# EasyEDA Pro project ProPrj_W51F6240S16_DEVB_V2_2026-07-19.epro

# Schematic Schematic1
Board Name: Board1; Create Date: 2026-07-16; Page Name: P1; Project Name: W51F6240S16_DEVB_V2; Schematic Name: Schematic1; Update Date: 2026-07-17; Company: EasyEDA.com; Page Size: A4; Version: V1.0
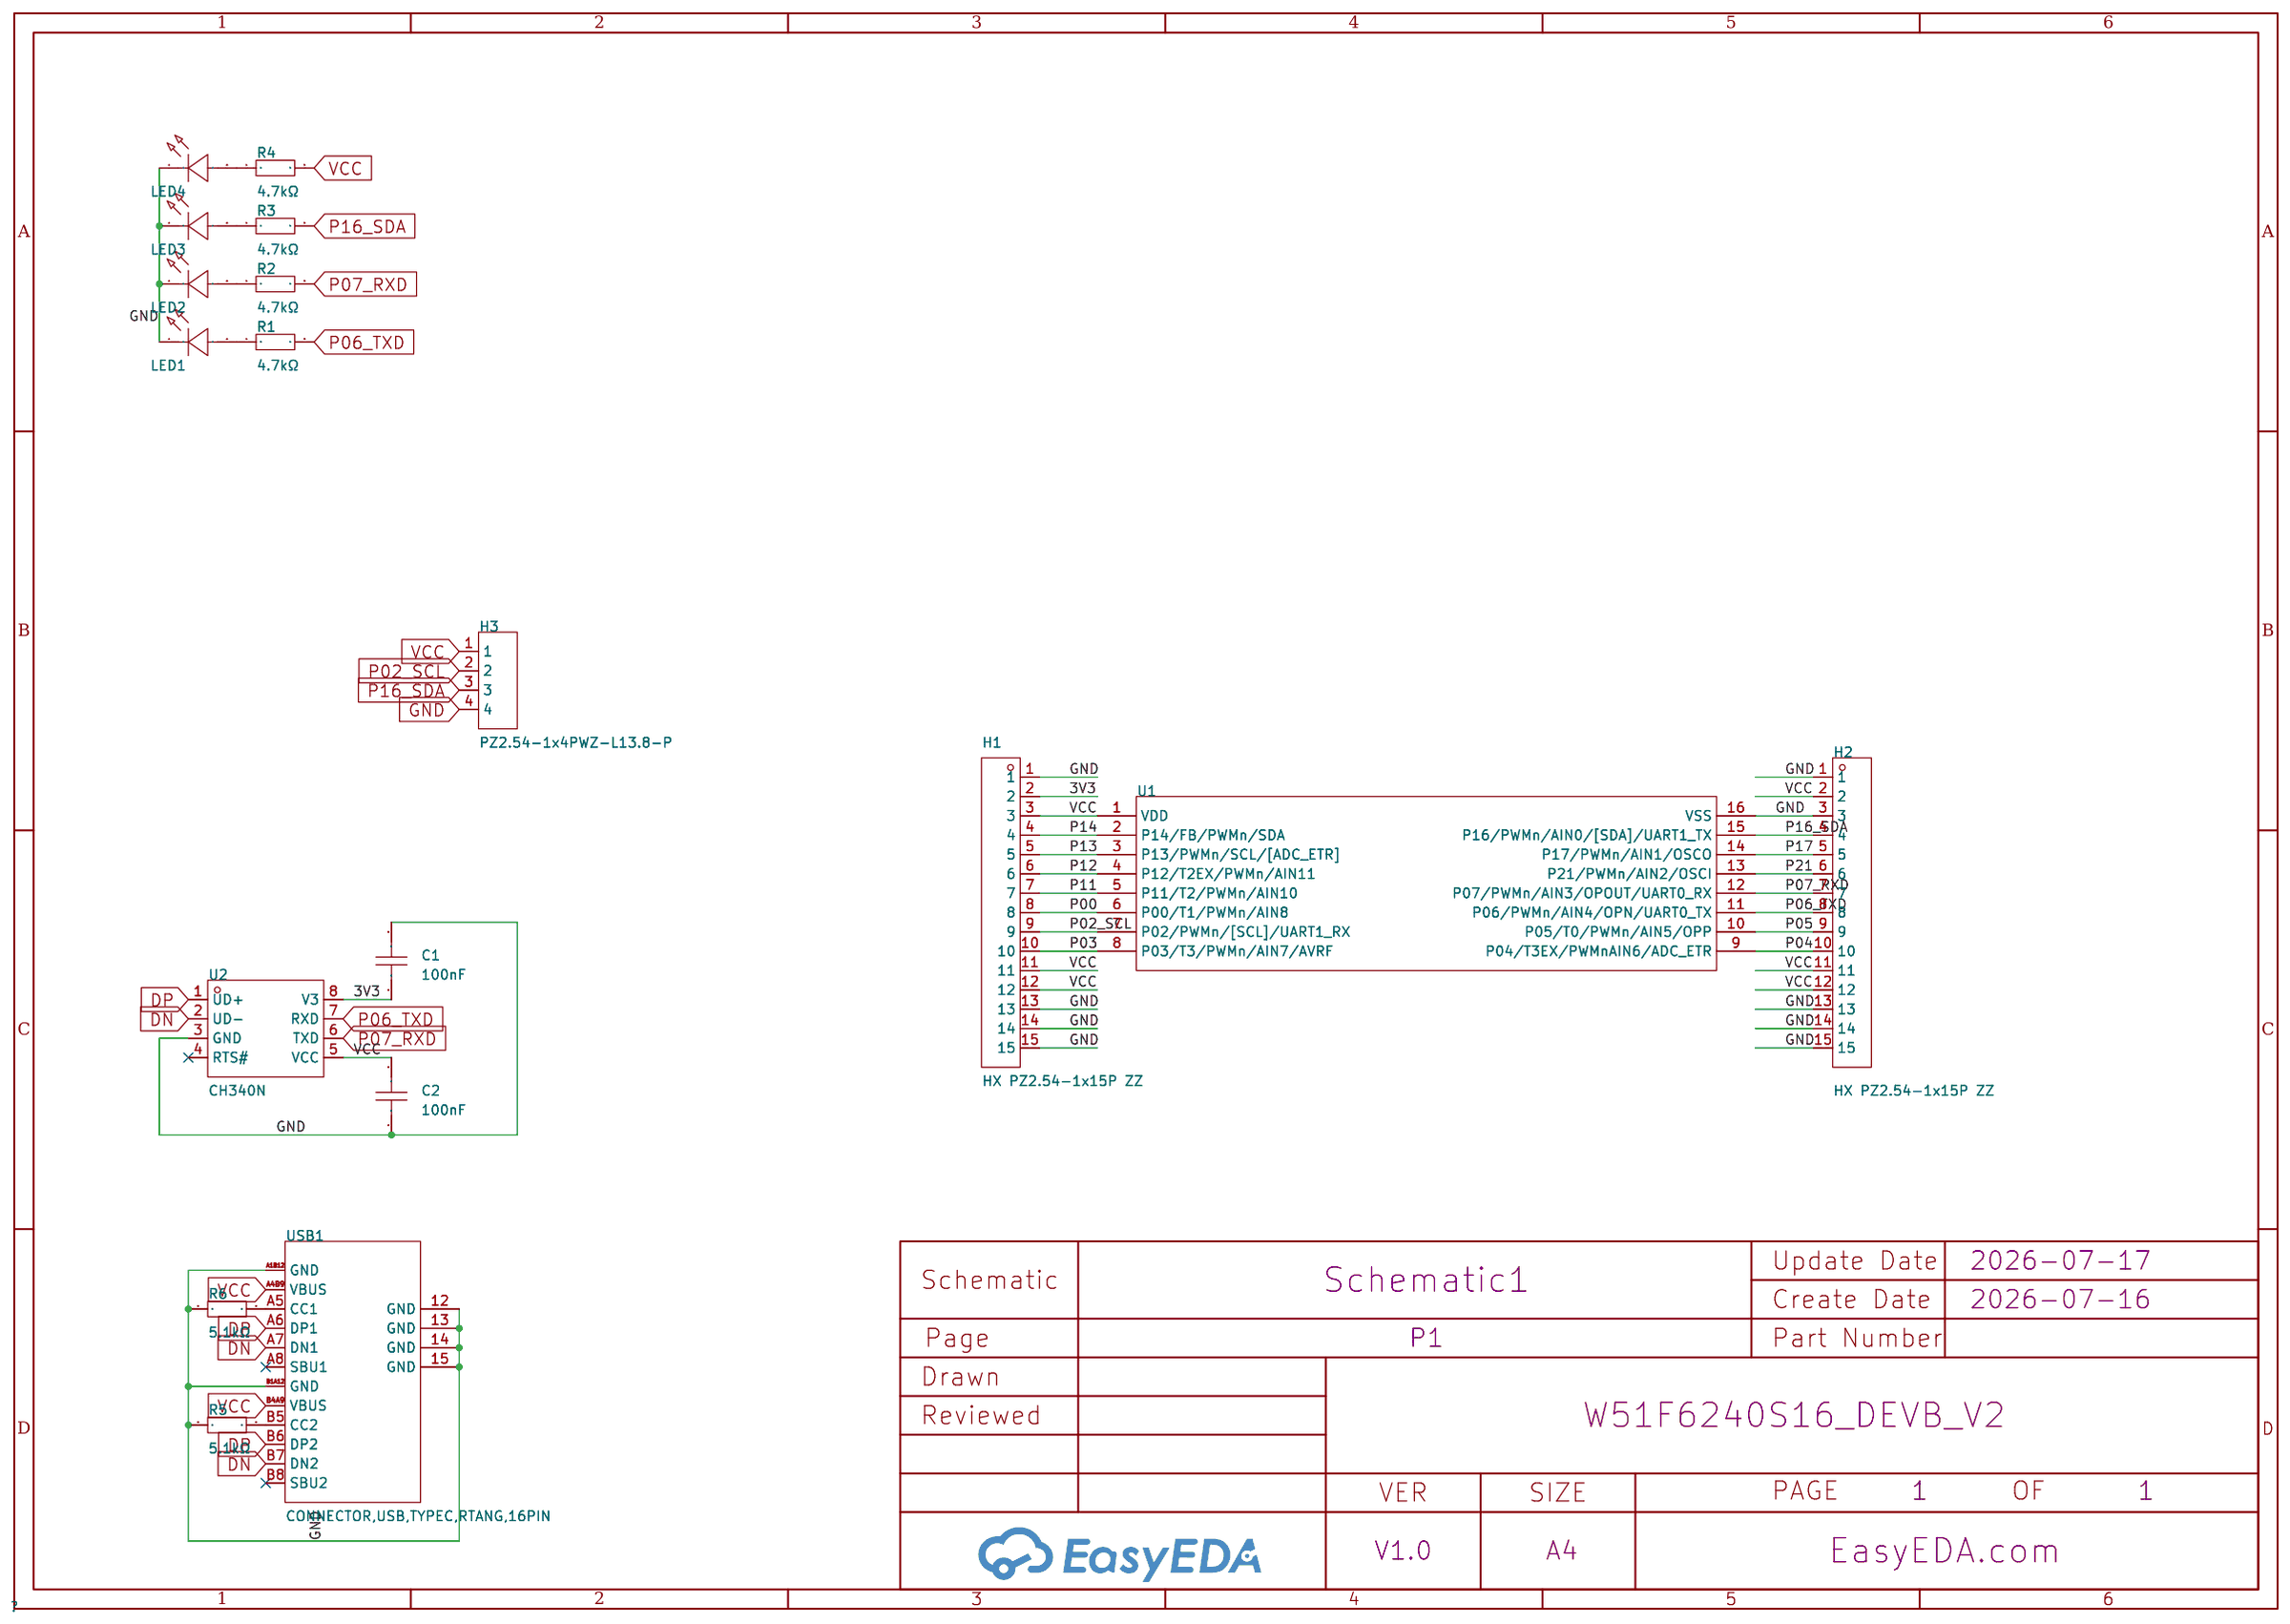
[diagram p0: schematic sheet]

## Parts
C1  100nF  [C1206]
C2  100nF  [C1206]
H1  HX PZ2.54-1x15P ZZ  [HDR-TH_15P-P2.54-V-M]
H2  HX PZ2.54-1x15P ZZ  [HDR-TH_15P-P2.54-V-M]
H3  PZ2.54-1x4PWZ-L13.8-P  [HDR-TH_4P-P2.54-H-M-W7.7-P]
LED1  LED1206  [LED1206-RD]
LED2  LED1206  [LED1206-RD]
LED3  LED1206  [LED1206-RD]
LED4  LED1206  [LED1206-RD]
R1  4.7kΩ  [R1206]
R2  4.7kΩ  [R1206]
R3  4.7kΩ  [R1206]
R4  4.7kΩ  [R1206]
R5  5.1kΩ  [R1206]
R6  5.1kΩ  [R1206]
U1  -  [SOP-16_L10.0-W3.9-P1.27-LS6.0-TR]
U2  CH340N  [SOP-8_L5.0-W4.0-P1.27-LS6.0-BL]
USB1  CONNECTOR,USB,TYPEC,RTANG,16PIN  [USB-SMD_TYPEC-16PIN]

## Library data of the parts
C1 C2 = FN31N104J500EPG: Capacitance:100nF Tolerance:±5% Tolerance:±5% Voltage Rating:50V Temperature Coefficient:C0G; LCSC Part Name: 100nF ±5% 50V; Supplier Part: C2874765; Manufacturer: PSA(信昌电陶); Supplier Footprint: 1206; JLCPCB Part Class: Extended Part; Datasheet: https://item.szlcsc.com/datasheet/FN31N104J500EPG/3080170.html; Supplier: LCSC; Tolerance: ±5%; Voltage Rating: 50V; Temperature Coefficient: C0G
H1 H2 = HX PZ2.54-1x15P ZZ: Pin Structure:1x15P Pitch:2.54mm Row Spacing:- Circluar Pins/Square Pins:Pin Header Mounting Type:Through Hole Number of Rows:1 Number of Pins:15P Current Rating:3A Voltage Rating (Max):1kV Length of Mating Pin:6mm Insulation Height:2.5mm Length of End Co; LCSC Part Name: 1x15P 间距:2.54mm 方针 直插; Supplier Part: C42372507; Manufacturer: hanxia(韩下); Supplier Footprint: 插件,P=2.54mm; Datasheet: https://item.szlcsc.com/datasheet/HX%2520PZ2.54-1x15P%2520ZZ/44255748.html; Supplier: LCSC; Pin Structure: 1x15P; Pitch: 2.54mm; Circluar Pins/Square Pins: Pin Header; Mounting Type: Through Hole; Number of Rows: 1; Number of Pins: 15P; Current Rating: 3A; Voltage Rating (Max): 1kV; Length of Mating Pin: 6mm; Insulation Height: 2.5mm; Length of End Connection Pin: 3mm; Contact Material: Brass; Contact Plating: Gold; Operating Temperature: -40℃~+105℃; Color: Black
H3 = PZ2.54-1x4PWZ-L13.8-P: Pin Structure:1x4P Pitch:2.54mm Row Spacing:2.54mm Circluar Pins/Square Pins:Pin Header Mounting Type:Right Angle Number of Rows:1 Number of Pins:4P Current Rating:3A Voltage Rating (Max):250V Length of Mating Pin:6mm Insulation Height:2.5mm Length of End; LCSC Part Name: 1x4P 间距:2.54mm 方针 弯插; Supplier Part: C54907654; Manufacturer: SHOU HAN(首韩); Supplier Footprint: 弯插,P=2.54mm; JLCPCB Part Class: Extended Part; Datasheet: https://item.szlcsc.com/datasheet/PZ2.54-1x4PWZ-L13.8-P/58437423.html; Supplier: LCSC; Pin Structure: 1x4P; Pitch: 2.54mm; Row Spacing: 2.54mm; Circluar Pins/Square Pins: Pin Header; Mounting Type: Right Angle; Number of Rows: 1; Number of Pins: 4P; Current Rating: 3A; Voltage Rating (Max): 250V; Length of Mating Pin: 6mm; Insulation Height: 2.5mm; Length of End Connection Pin: 3mm; Contact Material: Brass; Contact Plating: Gold; Operating Temperature: -40℃~+105℃; Color: Black
LED1-LED4 = LED1206: Supplier Part: C9900027223; JLCPCB Part Class: Extended Part; Supplier: LCSC
R1-R4 = RS-06K472FT: Type:Thick Film Resistors Resistance:4.7kΩ Tolerance:±1% Tolerance:±1% Power(Watts): Temperature Coefficient:±100ppm/℃ Temperature Coefficient:±100ppm/℃; LCSC Part Name: 厚膜电阻 4.7kΩ ±1% 250mW; Supplier Part: C304895; Manufacturer: FH(风华); Supplier Footprint: 1206; JLCPCB Part Class: Extended Part; Datasheet: https://atta.szlcsc.com/upload/public/pdf/source/20190505/C118335_36085569433BA7FFC796E569DBFE3139.pdf; Supplier: LCSC; Type: Thick Film Resistors; Tolerance: ±1%; Temperature Coefficient: ±100ppm/℃
R5 R6 = AC1206FR-075K1L: Type:Thick Film Resistor Resistance:5.1kΩ Tolerance:±1% Tolerance:±1% Power(Watts):250mW Voltage-Supply(Max):200V Temperature Coefficient:±100ppm/℃ Temperature Coefficient:±100ppm/℃ Operating Temperature:-55℃~+155℃ Operating Temperature:-55℃~+155℃; LCSC Part Name: 厚膜电阻 5.1kΩ ±1% 250mW; Supplier Part: C229719; Manufacturer: YAGEO(国巨); Supplier Footprint: 1206; JLCPCB Part Class: Extended Part; Datasheet: https://item.szlcsc.com/datasheet/AC1206FR-075K1L/229699.html; Supplier: LCSC; Type: Thick Film Resistor; Tolerance: ±1%; Power(Watts): 250mW; Voltage-Supply(Max): 200V; Temperature Coefficient: ±100ppm/℃; Operating Temperature: -55℃~+155℃
U1 = W51F6240S16: Low cost 1T 8051 MCU
U2 = CH340N_C506813: Applications Function:USB to serial USB Protocol:USB 2.0 Number of Channels:- Voltage - Supply:3.3V；5V Voltage - Supply:3.3V；5V Data Rate:2Mbps Operating Temperature:-20℃~+70℃ Operating Temperature:-20℃~+70℃ Features:Programmable baud rate；Built-in clock; LCSC Part Name: USB转串口芯片CH340; Supplier Part: C506813; Manufacturer: WCH(南京沁恒); Supplier Footprint: SOP-8; JLCPCB Part Class: Extended Part; Datasheet: https://item.szlcsc.com/datasheet/CH340N/519976.html; Supplier: LCSC; Applications Function: USB to serial; USB Protocol: USB 2.0; Voltage - Supply: 3.3V；5V; Data Rate: 2Mbps; Operating Temperature: -20℃~+70℃; Features: Programmable baud rate；Built-in clock generator；Power-off protection；Power-on reset
USB1 = CONNECTOR,USB,TYPEC,RTANG,16PIN: Supplier Part: C9900022254; Supplier Footprint: USBTypeC; JLCPCB Part Class: Extended Part; Supplier: LCSC

## Nets
3V3: C1.1 H1.2 U2.8(V3)
GND: C1.2 C2.1 H1.1 H1.13 H1.14 H1.15 H2.1 H2.3 H2.13 H2.14 H2.15 H3.4 LED1.1(K) LED2.1(K) LED3.1(K) LED4.1(K) R5.1 R6.1 U1.16(VSS) U2.3(GND) USB1.12(GND) USB1.13(GND) USB1.14(GND) USB1.15(GND) USB1.A1B12(GND) USB1.B1A12(GND)
VCC: C2.2 H1.3 H1.11 H1.12 H2.2 H2.11 H2.12 H3.1 R4.2 U1.1(VDD) U2.5(VCC) USB1.A4B9(VBUS) USB1.B4A9(VBUS)
DN: U2.2(UD-) USB1.A7(DN1) USB1.B7(DN2)
DP: U2.1(UD+) USB1.A6(DP1) USB1.B6(DP2)
P00: H1.8 U1.6(P00/T1/PWMn/AIN8)
P02_SCL: H1.9 H3.2 U1.7(P02/PWMn/[SCL]/UART1_RX)
P03: H1.10 U1.8(P03/T3/PWMn/AIN7/AVRF)
P04: H2.10 U1.9(P04/T3EX/PWMnAIN6/ADC_ETR)
P05: H2.9 U1.10(P05/T0/PWMn/AIN5/OPP)
P06_TXD: H2.8 R1.2 U1.11(P06/PWMn/AIN4/OPN/UART0_TX) U2.7(RXD)
P07_RXD: H2.7 R2.2 U1.12(P07/PWMn/AIN3/OPOUT/UART0_RX) U2.6(TXD)
P11: H1.7 U1.5(P11/T2/PWMn/AIN10)
P12: H1.6 U1.4(P12/T2EX/PWMn/AIN11)
P13: H1.5 U1.3(P13/PWMn/SCL/[ADC_ETR])
P14: H1.4 U1.2(P14/FB/PWMn/SDA)
P16_SDA: H2.4 H3.3 R3.2 U1.15(P16/PWMn/AIN0/[SDA]/UART1_TX)
P17: H2.5 U1.14(P17/PWMn/AIN1/OSCO)
P21: H2.6 U1.13(P21/PWMn/AIN2/OSCI)
$1N5175: LED1.2(A) R1.1
$1N5302: LED2.2(A) R2.1
$1N5395: LED3.2(A) R3.1
$1N5488: LED4.2(A) R4.1
$1N6720: R6.2 USB1.A5(CC1)
$1N6759: R5.2 USB1.B5(CC2)

Not connected (* = marked no-connect by the designer): U2 4(RTS#)*; USB1 A8(SBU1)* B8(SBU2)*

# Board PCB1
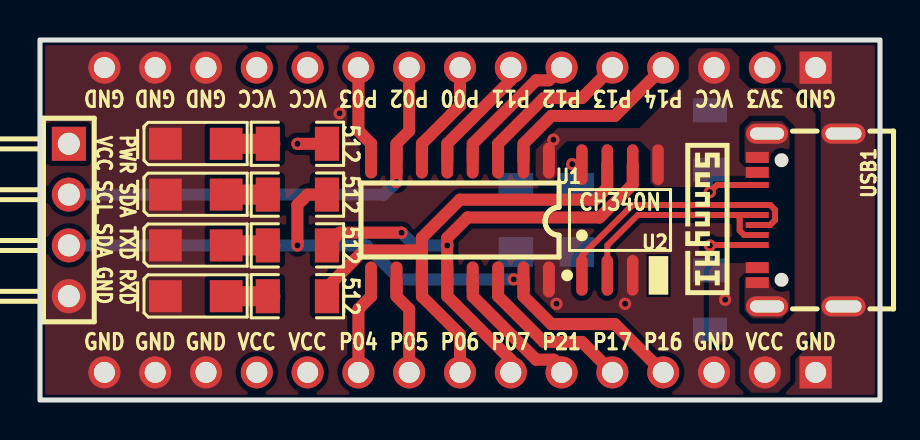
[diagram p1: board, top side]
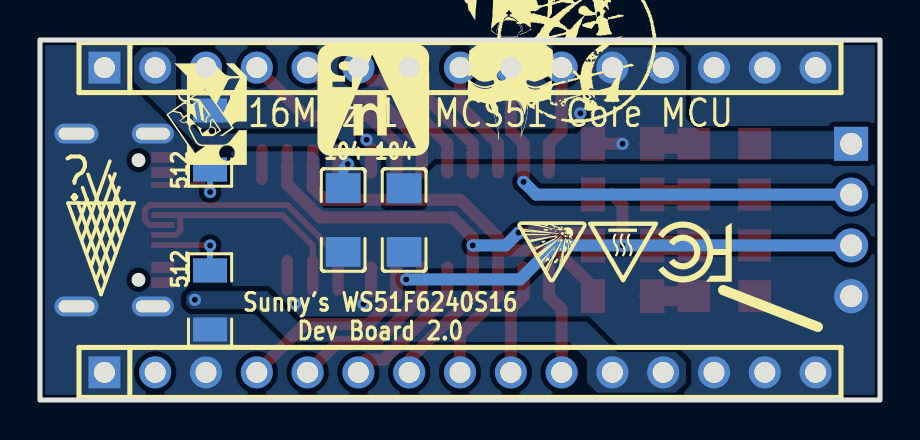
[diagram p2: board, bottom side, seen from below]

Outline 42 x 18 mm; copper layers: Top Layer, Bottom Layer. Coordinates in mm from the lower left corner of the outline.
Outline path: rectangle 42,18 0,0
Stack: Top Layer 0.035mm / Dielectric1 1.51mm FR4 er 4.5 / Bottom Layer 0.035mm

## Design rules (mm)
template: 自定义配置
spacing copperThickness1oz (default): track to track 0.102, other pairs 0.152 to 0.3
spacing copperThickness2oz: track to track 0.203, other pairs 0.152 to 0.3
track width copperThickness1oz (default): min 0.127, default 0.254, max 2.54
track width copperThickness2oz: min 0.203, default 0.254, max 2.54
differential pair differentialPair (default): width min 0.127, default 0.254, max 2.54; gap min 0.152, default 0.152
via viaSize (default): diameter min 0.5, default 0.61, max 10; hole min 0.3, default 0.305, max 6.3

## Placement (name value [footprint] x y rotation side)
C1  100nF  [C1206]  26.84 9 270 bottom
C2  100nF  [C1206]  23.79 9 90 bottom
H1  HX PZ2.54-1x15P ZZ  [HDR-TH_15P-P2.54-V-M]  21 16.62 180 bottom
H2  HX PZ2.54-1x15P ZZ  [HDR-TH_15P-P2.54-V-M]  21 1.38 180 bottom
H3  PZ2.54-1x4PWZ-L13.8-P  [HDR-TH_4P-P2.54-H-M-W7.7-P]  1.44 9 270 top
LED1  LED1206  [LED1206-RD]  7.79 5.19 0 top
LED2  LED1206  [LED1206-RD]  7.79 7.73 0 top
LED3  LED1206  [LED1206-RD]  7.79 10.27 0 top
LED4  LED1206  [LED1206-RD]  7.79 12.81 0 top
R1  4.7kΩ  [R1206]  12.87 5.19 0 top
R2  4.7kΩ  [R1206]  12.87 7.73 0 top
R3  4.7kΩ  [R1206]  12.87 10.27 0 top
R4  4.7kΩ  [R1206]  12.87 12.81 0 top
R5  5.1kΩ  [R1206]  33.5 13 270 bottom
R6  5.1kΩ  [R1206]  33.5 5 90 bottom
U1  -  [SOP-16_L10.0-W3.9-P1.27-LS6.0-TR]  21 9 0 top
U2  CH340N  [SOP-8_L5.0-W4.0-P1.27-LS6.0-BL]  29 9 0 top
USB1  CONNECTOR,USB,TYPEC,RTANG,16PIN  [USB-SMD_TYPEC-16PIN]  38.02 9 90 top

## Footprints (pads in the part's own frame, mm; a bottom-side part is the same pattern mirrored in y, then rotated)
C1206
  rect 1.485x1.728 smd: 1(-1.593,0) 2(1.593,0)
HDR-TH_4P-P2.54-H-M-W7.7-P
  rect 1.7x1.7 hole 1.1: 1(-3.81,0)
  round 1.7 hole 1.1: 2(-1.27,0) 3(1.27,0) 4(3.81,0)
HDR-TH_15P-P2.54-V-M
  rect 1.6x1.6 hole 1.05: 1(-17.78,0)
  round 1.6 hole 1.05: 2(-15.24,0) 3(-12.7,0) 4(-10.16,0) 5(-7.62,0) 6(-5.08,0) 7(-2.54,0) 8(0,0) 9(2.54,0) 10(5.08,0) 11(7.62,0) 12(10.16,0) 13(12.7,0) 14(15.24,0) 15(17.78,0)
LED1206-RD
  rect 1.635x1.6 smd: 1(-1.518,0) 2(1.518,0)
R1206
  rect 1.208x1.701 smd: 1(-1.479,0) 2(1.479,0)
SOP-8_L5.0-W4.0-P1.27-LS6.0-BL
  oval 0.574x2.035 smd: 1(-1.905,-2.768) 2(-0.635,-2.768) 3(0.635,-2.768) 5(1.905,2.768) 6(0.635,2.768) 7(-0.635,2.768) 8(-1.905,2.768)
SOP-16_L10.0-W3.9-P1.27-LS6.0-TR
  oval 0.6x1.8 smd: 1(4.445,2.971) 2(3.175,2.971) 3(1.905,2.971) 4(0.635,2.971) 5(-0.635,2.971) 6(-1.905,2.971) 7(-3.175,2.971) 8(-4.445,2.971) 9(-4.445,-2.972) 10(-3.175,-2.972) 11(-1.905,-2.972) 12(-0.635,-2.972) 13(0.635,-2.972) 14(1.905,-2.972) 15(3.175,-2.972) 16(4.445,-2.972)
USB-SMD_TYPEC-16PIN
  oval 1x2.1 hole 0.6x1.7: 12(-4.32,1.663) 13(4.32,1.663)
  oval 1x2.2 hole 0.6x1.8: 14(-4.32,-2.158) 15(4.32,-2.158)
  rect 0.55x1.15 smd: A1B12(-3.13,2.158) A4B9(-2.38,2.158) B1A12(3.131,2.158) B4A9(2.38,2.158)
  rect 0.3x1.15 smd: A5(-1.25,2.158) A6(-0.25,2.158) A7(0.25,2.158) B5(1.75,2.158) B6(0.75,2.158) B7(-0.75,2.158)

## Nets
As in the schematic.

## Via types
v1: diameter 0.61, hole 0.305, Top Layer to Bottom Layer, 14 vias

## Routing (per net, layer and track width the routed paths; a pad name or vN(x,y) marks a point on that pad's centre or on a via; arc(x,y) is an arc through that point)
3V3: length 1.8
  Top Layer w0.5: v1(26.61,11.79) 27.07,11.79 U2.8
  Bottom Layer w0.5: 26.84,10.59 26.84,11.57 v1(26.61,11.79)
GND:
  vias: v1(14.98,14.33) v1(25.82,4.81) v1(29.25,4.81)
VCC: length 1.5
  Top Layer w0.6: v1(12.87,12.81) 14.35,12.81
  vias: v1(25.67,13.01) v1(34.26,5.01)
DN: length 11.5
  Top Layer w0.254: 35.42,9.25 35.84,9.25
  Top Layer w0.3: 34.96,9.2 34.98,9.17 34.98,8.47 35.21,8.25 35.84,8.25 ; 34.96,9.2 34.96,9.21 34.96,9.25 ; 34.96,9.2 34.94,9.22 ; 34.96,9.2 34.92,9.2 34.94,9.22 ; 34.96,9.25 29.88,9.25 28.36,7.73 28.36,6.23 ; 34.96,9.25 34.94,9.22 ; 34.96,9.25 35.42,9.25
DP: length 13.3
  Top Layer w0.3: 35.84,8.75 36.51,8.75 36.74,8.97 36.74,8.99 36.75,9 36.75,9.5 36.74,9.51 36.74,9.52 36.51,9.75 USB1.B6 29.62,9.75 27.09,7.22 U2.1
P00: length 5.4
  Top Layer w0.6: H1.8 21,14.72 19.09,12.82 U1.6
P02_SCL: length 22.6
  Top Layer w0.6: v1(17.82,10.91) 17.82,11.97 U1.7 17.82,12.82 18.46,13.45 H1.9
  Bottom Layer w0.6: v1(17.82,10.91) 17.19,10.27 1.44,10.27
P03: length 4.9
  Top Layer w0.6: H1.10 15.92,13.46 16.55,12.82 U1.8
P04: length 4.9
  Top Layer w0.6: H2.10 15.92,4.54 16.55,5.18 U1.9
P05: length 4.9
  Top Layer w0.6: U1.10 17.82,5.18 18.46,4.55 H2.9
P06_TXD: length 24.9
  Top Layer w0.6: H2.8 21,3.27 19.09,5.18 U1.11 19.09,6.03 19.09,7.48 ; 14.35,5.19 14.35,5.64 16.19,7.48 19.09,7.48 ; 19.09,7.48 19.09,8.11 21,10.02 27.76,10.02 28.36,10.62 28.36,11.77
P07_RXD: length 26
  Top Layer w0.6: v1(18.08,8.36) 14.98,8.36 14.35,7.73 ; H2.7 23.54,2.01 20.36,5.19 20.36,6.03 20.36,6.03 v1(20.36,7.73) 20.36,8.11 21.38,9.13 27.98,9.13 29.63,10.78 U2.6
  Bottom Layer w0.6: v1(18.08,8.36) 18.71,7.73 v1(20.36,7.73)
P11: length 6
  Top Layer w0.6: 20.36,11.97 20.36,12.82 23.54,15.99 H1.7
P12: length 6.9
  Top Layer w0.6: U1.4 21.63,12.81 24.81,15.98 25.44,15.98 H1.6
P13: length 8.1
  Top Layer w0.6: H1.5 27.1,15.1 25.19,15.1 22.91,12.81 U1.3
P14: length 9.4
  Top Layer w0.6: U1.2 24.17,12.81 25.57,14.21 28.75,14.21 H1.4
P16_SDA: length 36.6
  Top Layer w0.254: v1(23.69,6.03) U1.15
  Top Layer w0.6: H2.4 28.75,3.79 25.57,3.79 24.17,5.19 U1.15 ; 14.35,10.27 13.38,10.27 12.87,9.76 v1(12.87,7.73)
  Bottom Layer w0.6: v1(23.69,6.03) 18,6.03 16.3,7.73 v1(12.87,7.73) 1.44,7.73
P17: length 8.1
  Top Layer w0.6: U1.14 22.91,5.19 25.19,2.9 27.1,2.9 H2.5
P21: length 7
  Top Layer w0.6: H2.6 26.08,1.63 25.7,2.02 24.81,2.02 21.63,5.19 U1.13
$1N5175: length 2.1
  Top Layer w1: 9.43,5.19 11.52,5.19
$1N5302: length 2.1
  Top Layer w1: 9.43,7.73 11.52,7.73
$1N5395: length 2.1
  Top Layer w1: 9.43,10.27 11.52,10.27
$1N5488: length 2.1
  Top Layer w1: 9.43,12.81 11.52,12.81
$1N6720: length 3.6
  Top Layer w0.3: v1(33.49,7.72) 33.52,7.75 35.84,7.75
  Bottom Layer w0.3: 33.5,6.48 33.5,7.72 v1(33.49,7.72)
$1N6759: length 3.6
  Top Layer w0.3: 35.84,10.75 33.85,10.75 v1(33.49,10.4)
  Bottom Layer w0.3: 33.5,11.52 33.49,11.52 v1(33.49,10.4)

## Copper pours and planes (outline as drawn; the poured copper is in the pictures)
3V3 on Bottom Layer: 25.95,17.64 37.31,17.64 37.31,9.89 25.95,9.89
GND on Top Layer: 42.08,17.89 42.08,0.11 0.17,0.11 0.17,17.89
GND on Bottom Layer: 42.08,17.89 42.08,0.11 0.17,0.11 0.17,17.89
VCC on Top Layer: 24.78,17.59 38.78,17.59 38.78,0.36 24.78,0.36
VCC on Bottom Layer: 9.7,5.44 34.68,5.44 34.68,0.36 9.7,0.36
VCC on Bottom Layer: 0.68,17.64 25.98,17.64 25.98,9.76 0.68,9.76

## Text on the board
Bottom Silkscreen Layer: 512 | 104 | Sunny's WS51F6240S16 / Dev Board 2.0 | 16MHz 1T MCS51 Core MCU | 💩
Top Silkscreen Layer: VCC SCL SDA GND | PWR SDA TXD RXD | 512 | GND | VCC | P04 | P05 | P06 | P07 | P21 | P17 | P16 | P03 | P02 | P00 | P11 | P14 | 3V3 | P12 | P13 | CH340N
